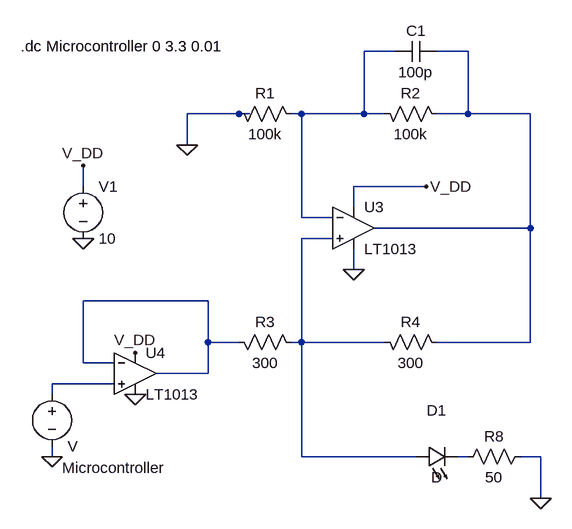
[diagram p0: schematic Final.asc]
Final.asc, the LTspice schematic file:
Version 4
SHEET 1 880 680
WIRE 400 -192 352 -192
WIRE 512 -192 464 -192
WIRE 160 -96 80 -96
WIRE 176 -96 160 -96
WIRE 256 -96 240 -96
WIRE 352 -96 352 -192
WIRE 352 -96 256 -96
WIRE 384 -96 352 -96
WIRE 512 -96 512 -192
WIRE 512 -96 464 -96
WIRE 608 -96 512 -96
WIRE 80 -48 80 -96
WIRE -80 16 -80 -16
WIRE 448 16 336 16
WIRE 336 48 336 16
WIRE 256 64 256 -96
WIRE 304 64 256 64
WIRE 608 80 608 -96
WIRE 608 80 368 80
WIRE 304 96 256 96
WIRE 336 144 336 112
WIRE 112 192 -80 192
WIRE 112 256 112 192
WIRE 160 256 112 256
WIRE 256 256 256 96
WIRE 256 256 240 256
WIRE 384 256 256 256
WIRE 608 256 608 80
WIRE 608 256 464 256
WIRE -80 288 -80 192
WIRE -32 288 -80 288
WIRE 112 304 112 256
WIRE 112 304 32 304
WIRE -32 320 -128 320
WIRE -128 336 -128 320
WIRE -128 432 -128 416
WIRE 256 432 256 256
WIRE 432 432 256 432
WIRE 512 432 496 432
WIRE 624 432 592 432
WIRE 624 496 624 432
FLAG 336 144 0
FLAG 624 496 0
FLAG 0 336 0
FLAG 80 -48 0
FLAG -80 96 0
FLAG -80 -16 V_DD
FLAG 448 16 V_DD
FLAG 0 272 V_DD
FLAG -128 432 0
SYMBOL res 256 -80 M270
WINDOW 0 32 56 VTop 2
WINDOW 3 0 56 VBottom 2
SYMATTR InstName R1
SYMATTR Value 100k
SYMBOL res 480 -80 M270
WINDOW 0 32 56 VTop 2
WINDOW 3 0 56 VBottom 2
SYMATTR InstName R2
SYMATTR Value 100k
SYMBOL res 256 272 M270
WINDOW 0 32 56 VTop 2
WINDOW 3 0 56 VBottom 2
SYMATTR InstName R3
SYMATTR Value 300
SYMBOL res 480 272 M270
WINDOW 0 32 56 VTop 2
WINDOW 3 0 56 VBottom 2
SYMATTR InstName R4
SYMATTR Value 300
SYMBOL voltage -80 0 R0
SYMATTR InstName V1
SYMATTR Value 10
SYMBOL voltage -128 320 R0
WINDOW 0 16 129 Left 2
SYMATTR InstName Microcontroller
SYMBOL LED 432 448 R270
WINDOW 0 72 32 VTop 2
WINDOW 3 0 32 VBottom 2
SYMATTR InstName D1
SYMBOL res 496 448 R270
WINDOW 0 32 56 VTop 2
WINDOW 3 0 56 VBottom 2
SYMATTR InstName R8
SYMATTR Value 50
SYMBOL Opamps/LT1013 336 16 R0
SYMATTR InstName U3
SYMBOL Opamps/LT1013 0 240 R0
SYMATTR InstName U4
SYMBOL cap 464 -208 R90
WINDOW 0 0 32 VBottom 2
WINDOW 3 32 32 VTop 2
SYMATTR InstName C1
SYMATTR Value 100p
TEXT -176 -200 Left 2 !.dc Microcontroller 0 3.3 0.01

The netlist it stands for:
* Final.asc
R1 N001 0 100k
R2 N002 N001 100k
R3 N003 N004 300
R4 N002 N003 300
V1 V_DD 0 10
V§Microcontroller N005 0 V
D1 N003 N006 D
R8 N006 0 50
XU3 N003 N001 V_DD 0 N002 LT1013  ; pins In+ In- V+ V- OUT
XU4 N005 N004 V_DD 0 N004 LT1013  ; pins In+ In- V+ V- OUT
C1 N002 N001 100p
.model D D
.lib standard.dio
.dc Microcontroller 0 3.3 0.01
.lib LTC.lib
.backanno
.end